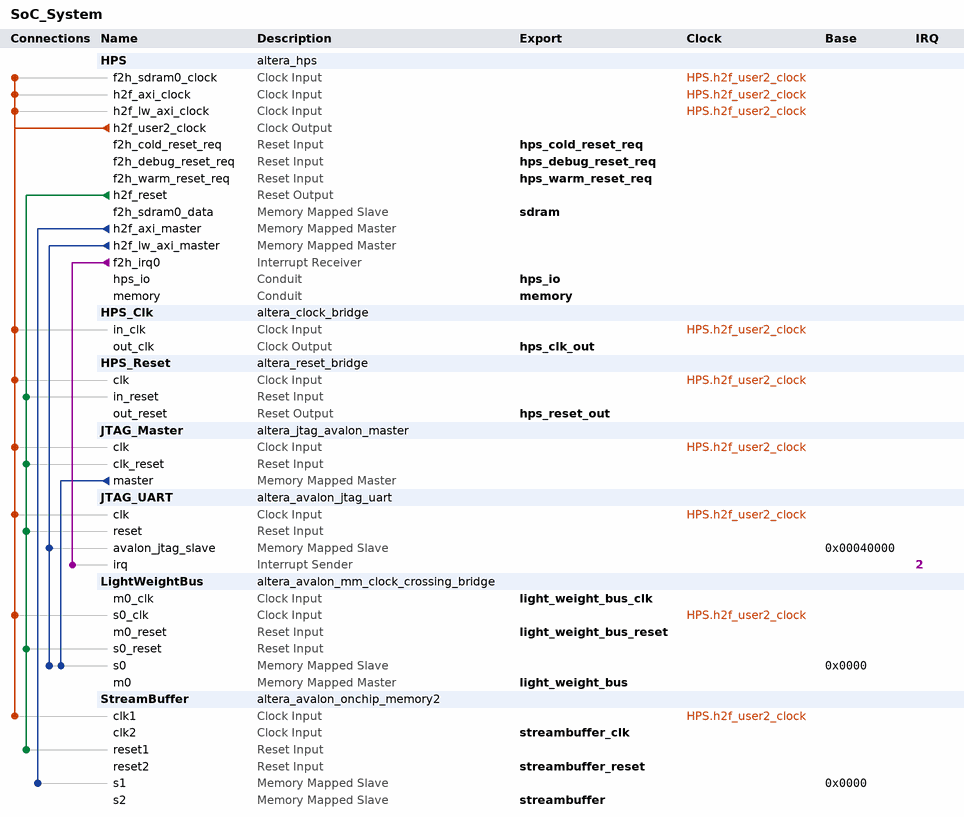
[diagram p0: system contents]
# Platform Designer (Qsys) system SoC_System, Cyclone V 5CSEMA4U23C6
# Parameters at their usual value, and those the tool derives, are not listed.
package require -exact qsys 20.1
create_system SoC_System
set_project_property DEVICE_FAMILY {Cyclone V}
set_project_property DEVICE 5CSEMA4U23C6

add_instance HPS altera_hps 20.1
set_instance_parameter_value HPS EMAC1_Mode RGMII
set_instance_parameter_value HPS EMAC1_PinMuxing {HPS I/O Set 0}
set_instance_parameter_value HPS F2SCLK_COLDRST_Enable true
set_instance_parameter_value HPS F2SCLK_DBGRST_Enable true
set_instance_parameter_value HPS F2SCLK_WARMRST_Enable true
set_instance_parameter_value HPS F2SDRAM_Type {Avalon-MM Bidirectional}
set_instance_parameter_value HPS F2SDRAM_Width 256
set_instance_parameter_value HPS F2SINTERRUPT_Enable true
set_instance_parameter_value HPS F2S_Width 0
set_instance_parameter_value HPS FPGA_PERIPHERAL_OUTPUT_CLOCK_FREQ_EMAC0_GTX_CLK 100
set_instance_parameter_value HPS FPGA_PERIPHERAL_OUTPUT_CLOCK_FREQ_EMAC0_MD_CLK 100.0
set_instance_parameter_value HPS FPGA_PERIPHERAL_OUTPUT_CLOCK_FREQ_EMAC1_GTX_CLK 100
set_instance_parameter_value HPS FPGA_PERIPHERAL_OUTPUT_CLOCK_FREQ_EMAC1_MD_CLK 100.0
set_instance_parameter_value HPS HPS_PROTOCOL DDR3
set_instance_parameter_value HPS I2C0_Mode I2C
set_instance_parameter_value HPS I2C0_PinMuxing {HPS I/O Set 0}
set_instance_parameter_value HPS I2C1_Mode I2C
set_instance_parameter_value HPS I2C1_PinMuxing {HPS I/O Set 0}
set_instance_parameter_value HPS LWH2F_Enable true
set_instance_parameter_value HPS MEM_BANKADDR_WIDTH 3
set_instance_parameter_value HPS MEM_CLK_FREQ 400.0
set_instance_parameter_value HPS MEM_COL_ADDR_WIDTH 10
set_instance_parameter_value HPS MEM_DQ_WIDTH 32
set_instance_parameter_value HPS MEM_DRV_STR RZQ/6
set_instance_parameter_value HPS MEM_ROW_ADDR_WIDTH 15
set_instance_parameter_value HPS MEM_RTT_NOM RZQ/6
set_instance_parameter_value HPS MEM_RTT_WR {Dynamic ODT off}
set_instance_parameter_value HPS MEM_TCL 7
set_instance_parameter_value HPS MEM_TFAW_NS 37.5
set_instance_parameter_value HPS MEM_TRAS_NS 35.0
set_instance_parameter_value HPS MEM_TRCD_NS 13.75
set_instance_parameter_value HPS MEM_TRFC_NS 300.0
set_instance_parameter_value HPS MEM_TRP_NS 13.75
set_instance_parameter_value HPS MEM_VENDOR Other
set_instance_parameter_value HPS MEM_WTCL 7
set_instance_parameter_value HPS QSPI_Mode N/A
set_instance_parameter_value HPS QSPI_PinMuxing Unused
set_instance_parameter_value HPS REF_CLK_FREQ 25.0
set_instance_parameter_value HPS S2FCLK_USER2CLK 7
set_instance_parameter_value HPS S2FCLK_USER2CLK_Enable true
set_instance_parameter_value HPS S2F_Width 1
set_instance_parameter_value HPS SDIO_Mode {4-bit Data}
set_instance_parameter_value HPS SDIO_PinMuxing {HPS I/O Set 0}
set_instance_parameter_value HPS SPIM1_Mode {Single Slave Select}
set_instance_parameter_value HPS SPIM1_PinMuxing {HPS I/O Set 0}
set_instance_parameter_value HPS STM_Enable false
set_instance_parameter_value HPS TIMING_BOARD_AC_SKEW 0.02
set_instance_parameter_value HPS TIMING_BOARD_AC_TO_CK_SKEW 0.0
set_instance_parameter_value HPS TIMING_BOARD_DQ_TO_DQS_SKEW 0.0
set_instance_parameter_value HPS TIMING_BOARD_MAX_CK_DELAY 0.6
set_instance_parameter_value HPS TIMING_BOARD_MAX_DQS_DELAY 0.6
set_instance_parameter_value HPS TIMING_BOARD_SKEW_BETWEEN_DQS 0.02
set_instance_parameter_value HPS TIMING_BOARD_SKEW_CKDQS_DIMM_MAX 0.01
set_instance_parameter_value HPS TIMING_BOARD_SKEW_CKDQS_DIMM_MIN -0.01
set_instance_parameter_value HPS TIMING_BOARD_SKEW_WITHIN_DQS 0.02
set_instance_parameter_value HPS TIMING_TDH 125
set_instance_parameter_value HPS TIMING_TDQSCK 400
set_instance_parameter_value HPS TIMING_TDQSQ 120
set_instance_parameter_value HPS TIMING_TDS 50
set_instance_parameter_value HPS TIMING_TIH 250
set_instance_parameter_value HPS TIMING_TIS 175
set_instance_parameter_value HPS TIMING_TQSH 0.38
set_instance_parameter_value HPS UART0_Mode {No Flow Control}
set_instance_parameter_value HPS UART0_PinMuxing {HPS I/O Set 0}
set_instance_parameter_value HPS USB1_Mode SDR
set_instance_parameter_value HPS USB1_PinMuxing {HPS I/O Set 0}
set_instance_parameter_value HPS desired_cfg_clk_mhz 92.5
set_instance_parameter_value HPS desired_qspi_clk_mhz 370.0

add_instance HPS_Clk altera_clock_bridge 20.1
set_instance_parameter_value HPS_Clk DERIVED_CLOCK_RATE 100000000
set_instance_parameter_value HPS_Clk EXPLICIT_CLOCK_RATE 0

add_instance HPS_Reset altera_reset_bridge 20.1
set_instance_parameter_value HPS_Reset ACTIVE_LOW_RESET 0
set_instance_parameter_value HPS_Reset SYNCHRONOUS_EDGES both

add_instance JTAG_Master altera_jtag_avalon_master 20.1

add_instance JTAG_UART altera_avalon_jtag_uart 20.1
set_instance_parameter_value JTAG_UART allowMultipleConnections true
set_instance_parameter_value JTAG_UART simInteractiveOptions INTERACTIVE_ASCII_OUTPUT

add_instance LightWeightBus altera_avalon_mm_clock_crossing_bridge 20.1
set_instance_parameter_value LightWeightBus ADDRESS_UNITS WORDS
set_instance_parameter_value LightWeightBus ADDRESS_WIDTH 16
set_instance_parameter_value LightWeightBus COMMAND_FIFO_DEPTH 4
set_instance_parameter_value LightWeightBus DATA_WIDTH 32
set_instance_parameter_value LightWeightBus MASTER_SYNC_DEPTH 2
set_instance_parameter_value LightWeightBus MAX_BURST_SIZE 1
set_instance_parameter_value LightWeightBus RESPONSE_FIFO_DEPTH 4
set_instance_parameter_value LightWeightBus SLAVE_SYNC_DEPTH 2
set_instance_parameter_value LightWeightBus USE_AUTO_ADDRESS_WIDTH 0

add_instance StreamBuffer altera_avalon_onchip_memory2 20.1
set_instance_parameter_value StreamBuffer dataWidth 32
set_instance_parameter_value StreamBuffer dualPort true
set_instance_parameter_value StreamBuffer enableDiffWidth true
set_instance_parameter_value StreamBuffer initMemContent false
set_instance_parameter_value StreamBuffer initializationFileName onchip_mem.hex
set_instance_parameter_value StreamBuffer memorySize 16384
set_instance_parameter_value StreamBuffer resetrequest_enabled false

# connections
add_connection HPS.h2f_user2_clock HPS.f2h_sdram0_clock clock
add_connection HPS.h2f_user2_clock HPS.h2f_axi_clock clock
add_connection HPS.h2f_user2_clock HPS.h2f_lw_axi_clock clock
add_connection HPS.h2f_user2_clock HPS_Clk.in_clk clock
add_connection HPS.h2f_user2_clock HPS_Reset.clk clock
add_connection HPS.h2f_user2_clock JTAG_Master.clk clock
add_connection HPS.h2f_user2_clock JTAG_UART.clk clock
add_connection HPS.h2f_user2_clock LightWeightBus.s0_clk clock
add_connection HPS.h2f_user2_clock StreamBuffer.clk1 clock
add_connection HPS.h2f_reset HPS_Reset.in_reset reset
add_connection HPS.h2f_reset JTAG_Master.clk_reset reset
add_connection HPS.h2f_reset JTAG_UART.reset reset
add_connection HPS.h2f_reset LightWeightBus.s0_reset reset
add_connection HPS.h2f_reset StreamBuffer.reset1 reset
add_connection HPS.h2f_axi_master StreamBuffer.s1 avalon
set_connection_parameter_value HPS.h2f_axi_master/StreamBuffer.s1 baseAddress 0x0000
add_connection HPS.h2f_lw_axi_master JTAG_UART.avalon_jtag_slave avalon
set_connection_parameter_value HPS.h2f_lw_axi_master/JTAG_UART.avalon_jtag_slave baseAddress 0x00040000
add_connection HPS.h2f_lw_axi_master LightWeightBus.s0 avalon
set_connection_parameter_value HPS.h2f_lw_axi_master/LightWeightBus.s0 baseAddress 0x0000
add_connection JTAG_Master.master LightWeightBus.s0 avalon
set_connection_parameter_value JTAG_Master.master/LightWeightBus.s0 baseAddress 0x0000
add_connection HPS.f2h_irq0 JTAG_UART.irq interrupt
set_connection_parameter_value HPS.f2h_irq0/JTAG_UART.irq irqNumber 2

# exported interfaces
add_interface hps_clk_out clock source
set_interface_property hps_clk_out EXPORT_OF HPS_Clk.out_clk
add_interface hps_cold_reset_req reset sink
set_interface_property hps_cold_reset_req EXPORT_OF HPS.f2h_cold_reset_req
add_interface hps_debug_reset_req reset sink
set_interface_property hps_debug_reset_req EXPORT_OF HPS.f2h_debug_reset_req
add_interface hps_io conduit end
set_interface_property hps_io EXPORT_OF HPS.hps_io
add_interface hps_reset_out reset source
set_interface_property hps_reset_out EXPORT_OF HPS_Reset.out_reset
add_interface hps_warm_reset_req reset sink
set_interface_property hps_warm_reset_req EXPORT_OF HPS.f2h_warm_reset_req
add_interface light_weight_bus avalon master
set_interface_property light_weight_bus EXPORT_OF LightWeightBus.m0
add_interface light_weight_bus_clk clock sink
set_interface_property light_weight_bus_clk EXPORT_OF LightWeightBus.m0_clk
add_interface light_weight_bus_reset reset sink
set_interface_property light_weight_bus_reset EXPORT_OF LightWeightBus.m0_reset
add_interface memory conduit end
set_interface_property memory EXPORT_OF HPS.memory
add_interface sdram avalon slave
set_interface_property sdram EXPORT_OF HPS.f2h_sdram0_data
add_interface streambuffer avalon slave
set_interface_property streambuffer EXPORT_OF StreamBuffer.s2
add_interface streambuffer_clk clock sink
set_interface_property streambuffer_clk EXPORT_OF StreamBuffer.clk2
add_interface streambuffer_reset reset sink
set_interface_property streambuffer_reset EXPORT_OF StreamBuffer.reset2

set_interconnect_requirement {$system} qsys_mm.clockCrossingAdapter HANDSHAKE
set_interconnect_requirement {$system} qsys_mm.maxAdditionalLatency 1

save_system SoC_System.qsys
